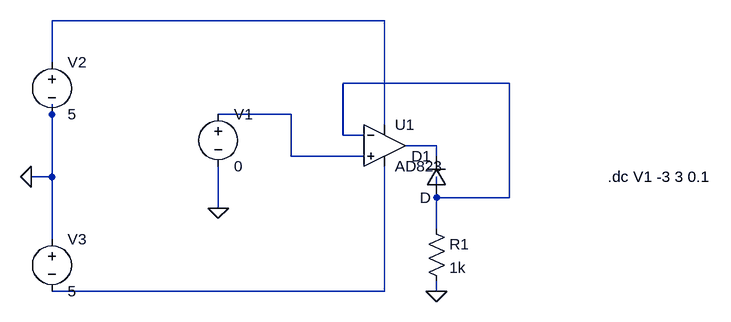
[diagram p0: schematic HW3.3.asc]
HW3.3.asc, the LTspice schematic file:
Version 4
SHEET 1 880 680
WIRE 368 240 -144 240
WIRE -144 304 -144 240
WIRE 560 336 304 336
WIRE -144 384 -144 368
WIRE 224 384 112 384
WIRE 368 400 368 240
WIRE 304 416 304 336
WIRE 336 416 304 416
WIRE 448 432 400 432
WIRE 224 448 224 384
WIRE 336 448 224 448
WIRE 448 448 448 432
WIRE -144 480 -144 384
WIRE -144 480 -176 480
WIRE 448 512 448 480
WIRE 560 512 560 336
WIRE 560 512 448 512
WIRE 112 528 112 464
WIRE 448 560 448 512
WIRE -144 576 -144 480
WIRE 368 656 368 464
WIRE 368 656 -144 656
WIRE 448 656 448 640
FLAG 448 656 0
FLAG 112 528 0
FLAG -176 480 0
SYMBOL voltage 112 368 R0
SYMATTR InstName V1
SYMATTR Value 0
SYMBOL diode 464 512 R180
WINDOW 0 24 64 Left 2
WINDOW 3 24 0 Left 2
SYMATTR InstName D1
SYMBOL Res 432 544 R0
SYMATTR InstName R1
SYMATTR Value 1k
SYMBOL OpAmps/AD823 368 368 R0
SYMATTR InstName U1
SYMBOL Voltage -144 288 R0
SYMATTR InstName V2
SYMATTR Value 5
SYMBOL Voltage -144 560 R0
SYMATTR InstName V3
SYMATTR Value 5
TEXT 712 480 Left 2 !.dc V1 -3 3 0.1

The netlist it stands for:
* HW3.3.asc
V1 N003 0 0
D1 N002 N004 D
R1 N002 0 1k
XU1 N003 N002 N001 N005 N004 AD823  ; pins In+ In- V+ V- OUT
V2 N001 0 5
V3 0 N005 5
.model D D
.lib standard.dio
.dc V1 -3 3 0.1
.lib ADI.lib
.backanno
.end